# EAGLE design NSE2022_FLYBACK (EAGLE 9.6.0)
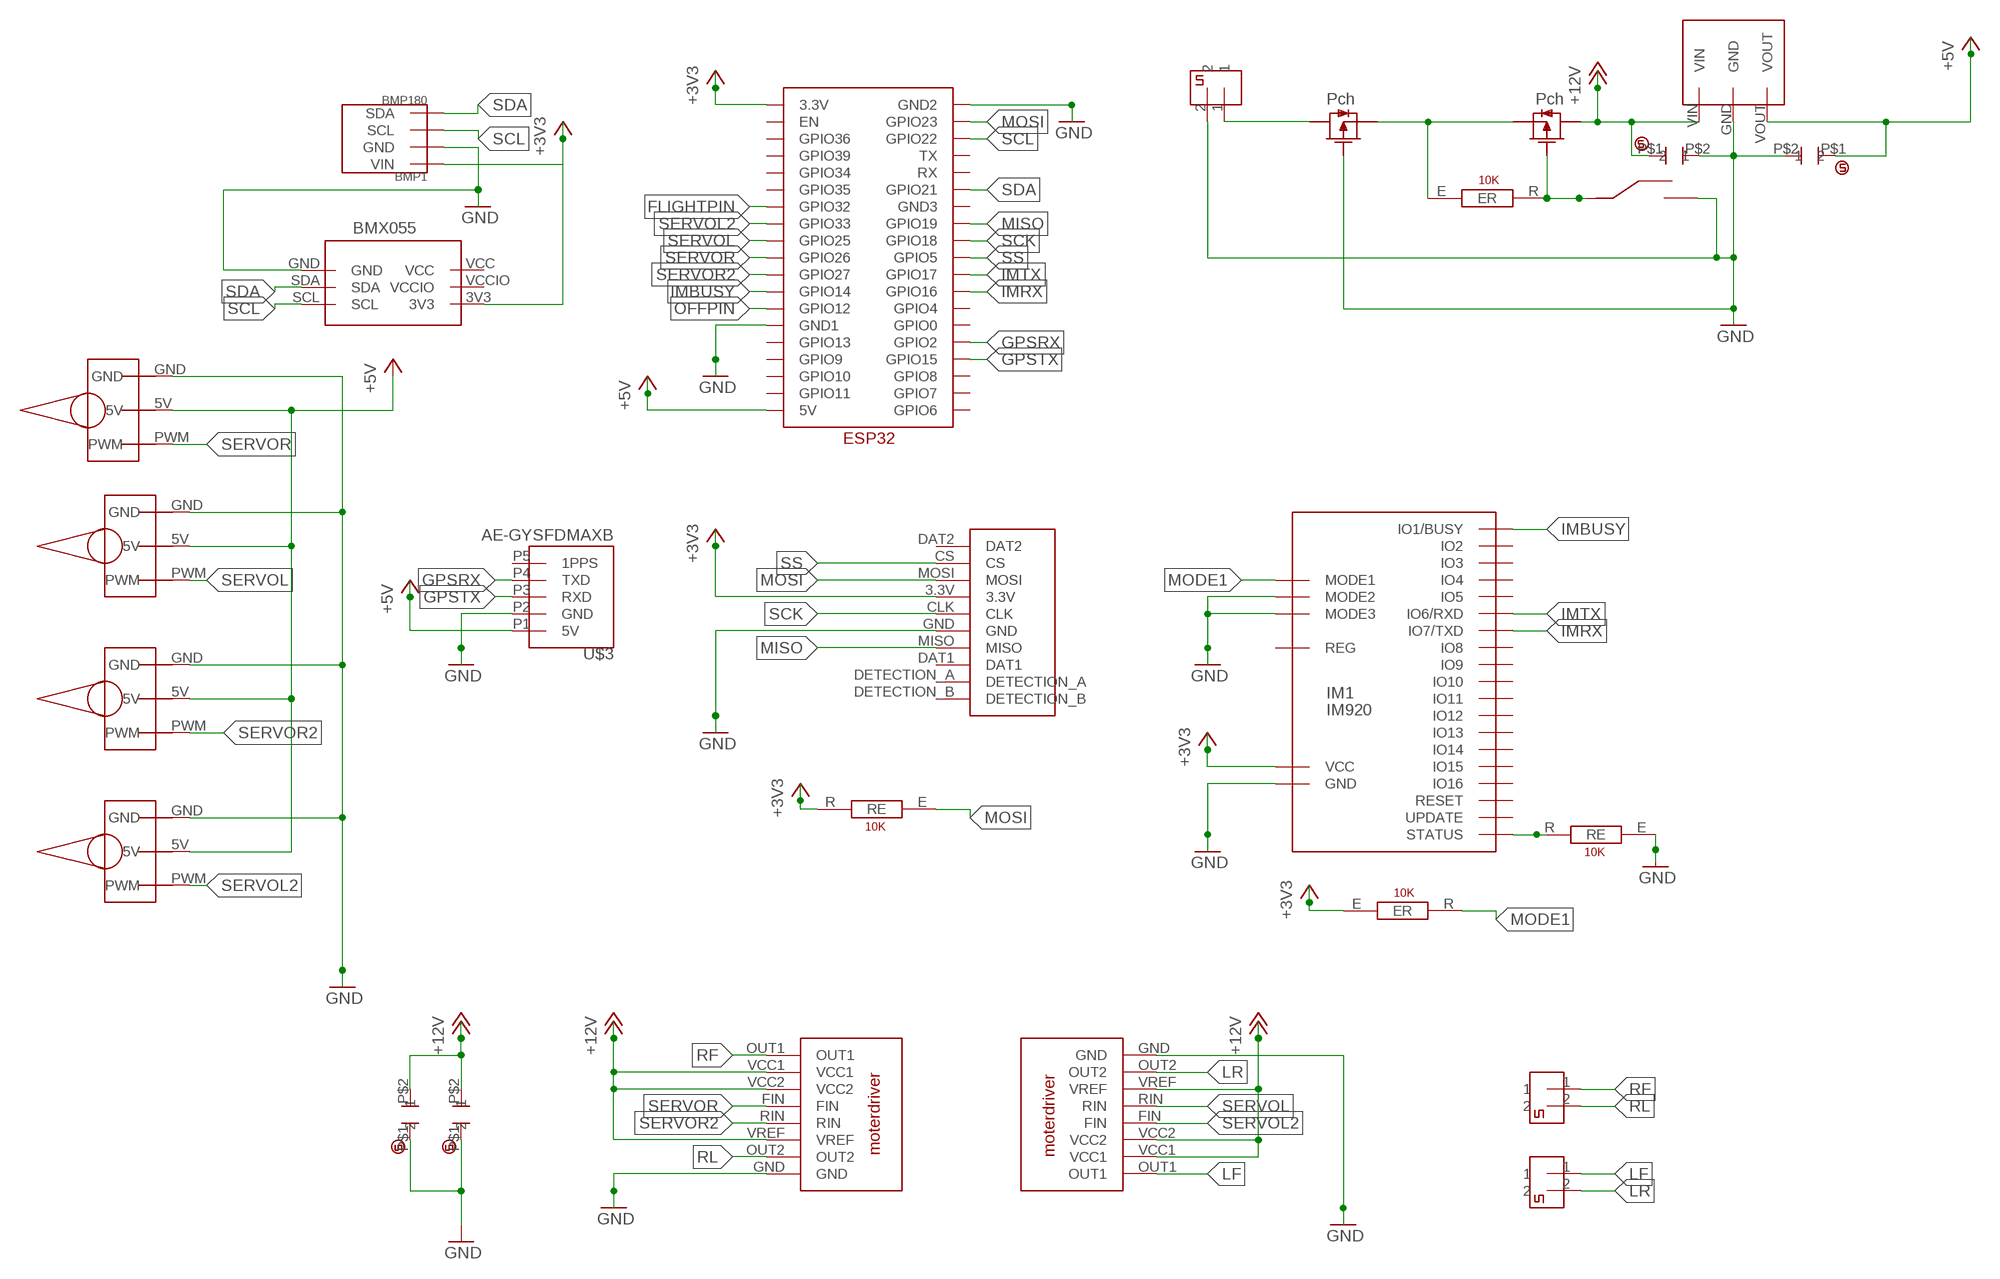
[diagram p0: schematic, sheet 1]

## Parts
BMP1  BMP180  [GY-68]
BMX1  BMX055  [BMX055]
CERAMIC_CAPACITOR1  CERAMIC_CAPACITOR  [CERAMIC_CAPACITOR]
CERAMIC_CAPACITOR2  CERAMIC_CAPACITOR  [CERAMIC_CAPACITOR]
CERAMIC_CAPACITOR3  CERAMIC_CAPACITOR  [CERAMIC_CAPACITOR]
CERAMIC_CAPACITOR4  CERAMIC_CAPACITOR  [CERAMIC_CAPACITOR]
CONNECTION1  SD_SOCKET  [SD]
CONNECTOR1  2PIN  [2PIN]
CONNECTOR2  2PIN  [2PIN]
CONNECTOR3  2PIN  [2PIN]
IM1  IM920  [IM920]
U$1  2SJ681-PCH  [2SJ681]
U$2  MG996R  [MG996R]
U$3  AE-GYSFDMAXB  [AE-GYSFDMAXB]
U$4  ESP32  [ESP32]
U$5  2SJ681-PCH  [2SJ681]
U$6  M78AR05-1  [M78AR05-1]
U$7  KATORESISTOR  [KATORESISTOR]
U$8  SLIDESWITCH  [SLIDESWITCH]
U$9  MG996R  [MG996R]
U$10  MG996R  [MG996R]
U$11  MG996R  [MG996R]
U$12  KATORESISTOR  [KATORESISTOR]
U$13  KATORESISTOR  [KATORESISTOR]
U$14  KATORESISTOR  [KATORESISTOR]
U$15  MOTORDRIVER  [MOTORDRIVER]
U$16  MOTORDRIVER  [MOTORDRIVER]

## Nets
+3V3: BMP1.P1(VIN) BMX1.3V3 CONNECTION1.3.3V IM1.IO23(VCC) U$4.3.3V U$12.E U$14.R
+5V: CERAMIC_CAPACITOR1.P$1 U$2.5V U$3.P1(5V) U$4.5V U$6.VOUT U$9.5V U$10.5V U$11.5V
+12V: CERAMIC_CAPACITOR2.P$1 CERAMIC_CAPACITOR3.P$2 CERAMIC_CAPACITOR4.P$2 U$5.DRAIN U$6.VIN U$15.VCC1 U$15.VCC2 U$15.VREF U$16.VCC1 U$16.VCC2 U$16.VREF
FLIGHTPIN: U$4.GPIO32
GND: BMP1.P2(GND) BMX1.GND CERAMIC_CAPACITOR1.P$2 CERAMIC_CAPACITOR2.P$2 CERAMIC_CAPACITOR3.P$1 CERAMIC_CAPACITOR4.P$1 CONNECTION1.GND CONNECTOR2.2 IM1.IO18(MODE2) IM1.IO19(MODE3) IM1.IO24(GND) U$1.GATE U$2.GND U$3.P2(GND) U$4.GND1 U$6.GND U$8.C U$9.GND U$10.GND U$11.GND U$13.E U$15.GND U$16.GND
GPSRX: U$3.P4(TXD) U$4.GPIO2
GPSTX: U$3.P3(RXD) U$4.GPIO15
IMBUSY: IM1.IO1(IO1/BUSY) U$4.GPIO14
IMRX: IM1.IO7(IO7/TXD) U$4.GPIO16
IMTX: IM1.IO6(IO6/RXD) U$4.GPIO17
LF: CONNECTOR3.1 U$16.OUT1
LR: CONNECTOR3.2 U$16.OUT2
MISO: CONNECTION1.MISO U$4.GPIO19
MODE1: IM1.IO17(MODE1) U$12.R
MOSI: CONNECTION1.MOSI U$4.GPIO23 U$14.E
N$1: U$4.GND2 ; supply symbol labelled GND
N$2: U$1.SOURCE U$5.SOURCE U$7.E
N$4: U$5.GATE U$7.R U$8.A
N$6: CONNECTOR2.1 U$1.DRAIN
N$25: IM1.IO21(STATUS) U$13.R
OFFPIN: U$4.GPIO12
RF: CONNECTOR1.1 U$15.OUT1
RL: CONNECTOR1.2 U$15.OUT2
SCK: CONNECTION1.CLK U$4.GPIO18
SCL: BMP1.P3(SCL) BMX1.SCL U$4.GPIO22
SDA: BMP1.P4(SDA) BMX1.SDA U$4.GPIO21
SERVOL: U$4.GPIO25 U$9.PWM U$16.RIN
SERVOL2: U$4.GPIO33 U$11.PWM U$16.FIN
SERVOR: U$2.PWM U$4.GPIO26 U$15.FIN
SERVOR2: U$4.GPIO27 U$10.PWM U$15.RIN
SS: CONNECTION1.CS U$4.GPIO5
Unconnected: CONNECTION1.DAT1 CONNECTION1.DAT2 CONNECTION1.DETECTION_A CONNECTION1.DETECTION_B IM1.IO2 IM1.IO3 IM1.IO4 IM1.IO5 IM1.IO8 IM1.IO9 IM1.IO10 IM1.IO11 IM1.IO12 IM1.IO13 IM1.IO14 IM1.IO15 IM1.IO16 IM1.IO20(UPDATE) IM1.IO22(REG) IM1.IO25(RESET) U$3.P5(1PPS) U$4.EN U$4.GND3 U$4.GPIO0 U$4.GPIO4 U$4.GPIO6 U$4.GPIO7 U$4.GPIO8 U$4.GPIO9 U$4.GPIO10 U$4.GPIO11 U$4.GPIO13 U$4.GPIO34 U$4.GPIO35 U$4.GPIO36 U$4.GPIO39 U$4.RX U$4.TX U$8.B

## Power pins joined to a net without a drawn wire
VCC: BMX1.VCC
VCCIO: BMX1.VCCIO

## Library data of the parts
BMP1 = BMP180:BMP180
BMX1 = BMX055:BMX055
CERAMIC_CAPACITOR1-CERAMIC_CAPACITOR4 = capacitor:CERAMIC_CAPACITOR: ceramic_capacitor
CONNECTION1 = SD_card_socket:SD_SOCKET: SD card socket
CONNECTOR1-CONNECTOR3 = 2pin_small:2PIN: 2pin
IM1 = IM920:IM920
U$1 U$5 = MOSFET:2SJ681-PCH
U$2 U$9-U$11 = MG996R:MG996R
U$3 = AE-GYSFDMAXB:AE-GYSFDMAXB
U$4 = ESP32:ESP32
U$6 = M78AR05-1:M78AR05-1
U$7 U$12-U$14 = KATORESISTER:KATORESISTOR
U$8 = SLIDESWITCH:SLIDESWITCH
U$15 U$16 = motordriver:MOTORDRIVER

## Board
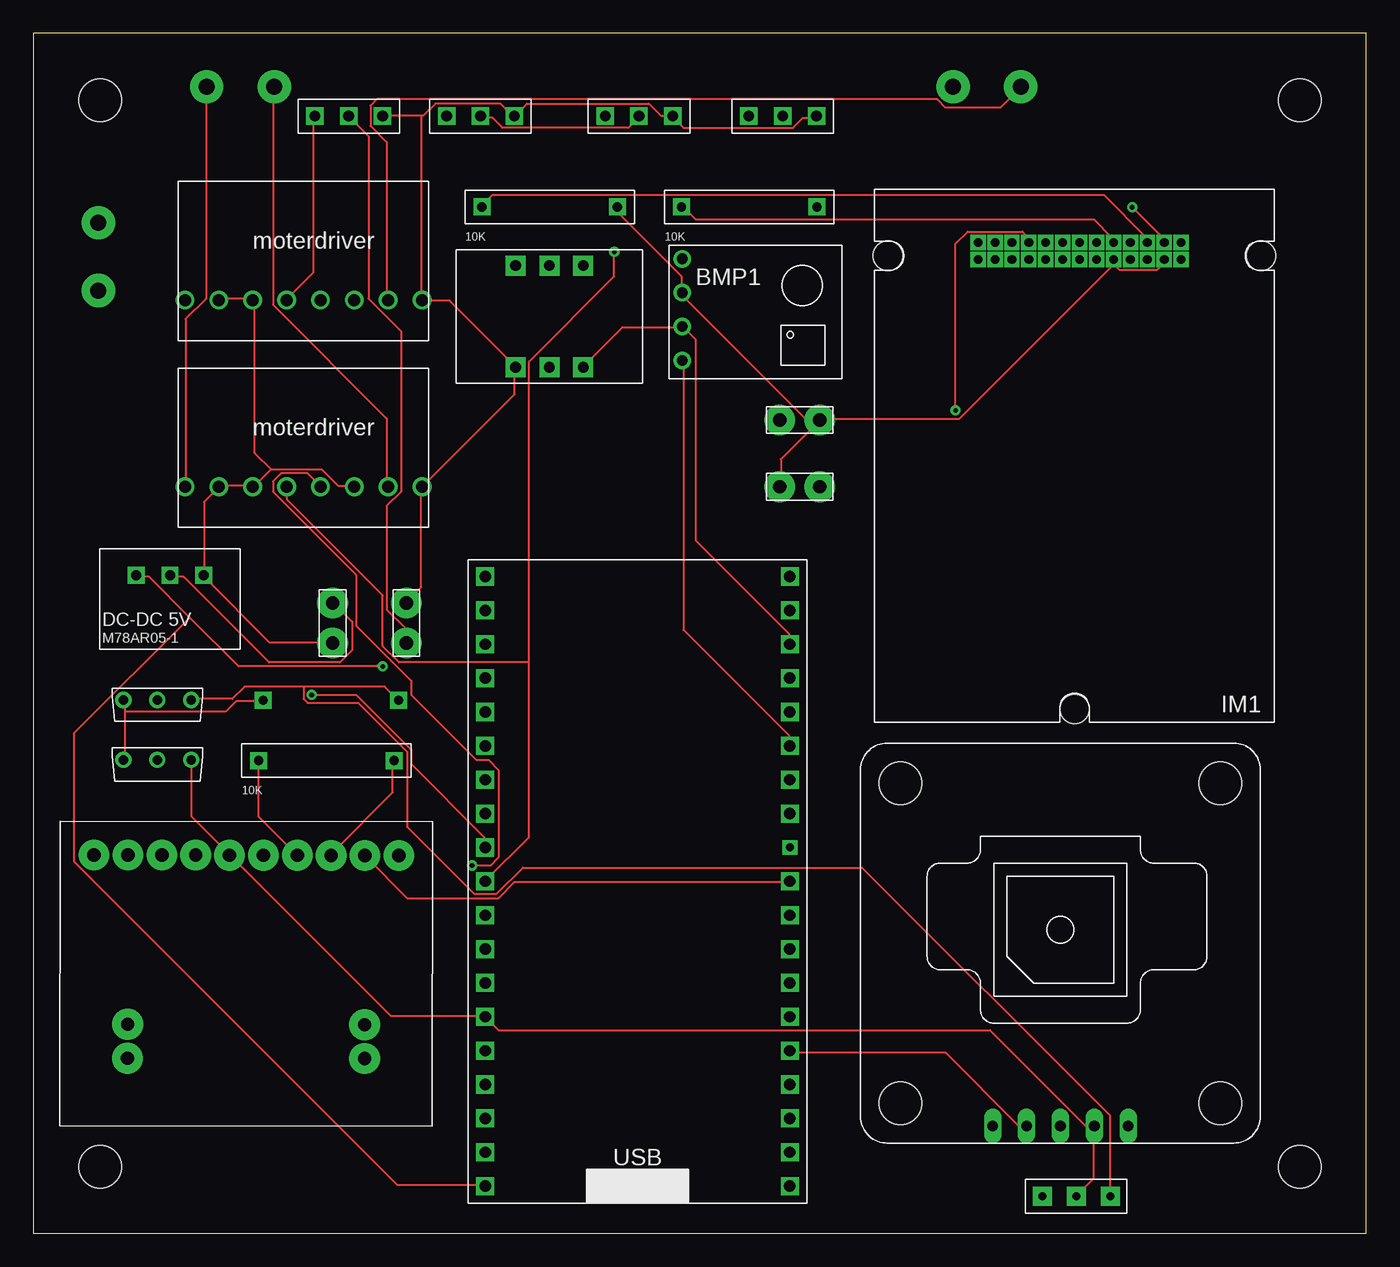
[diagram p1: board, top side]
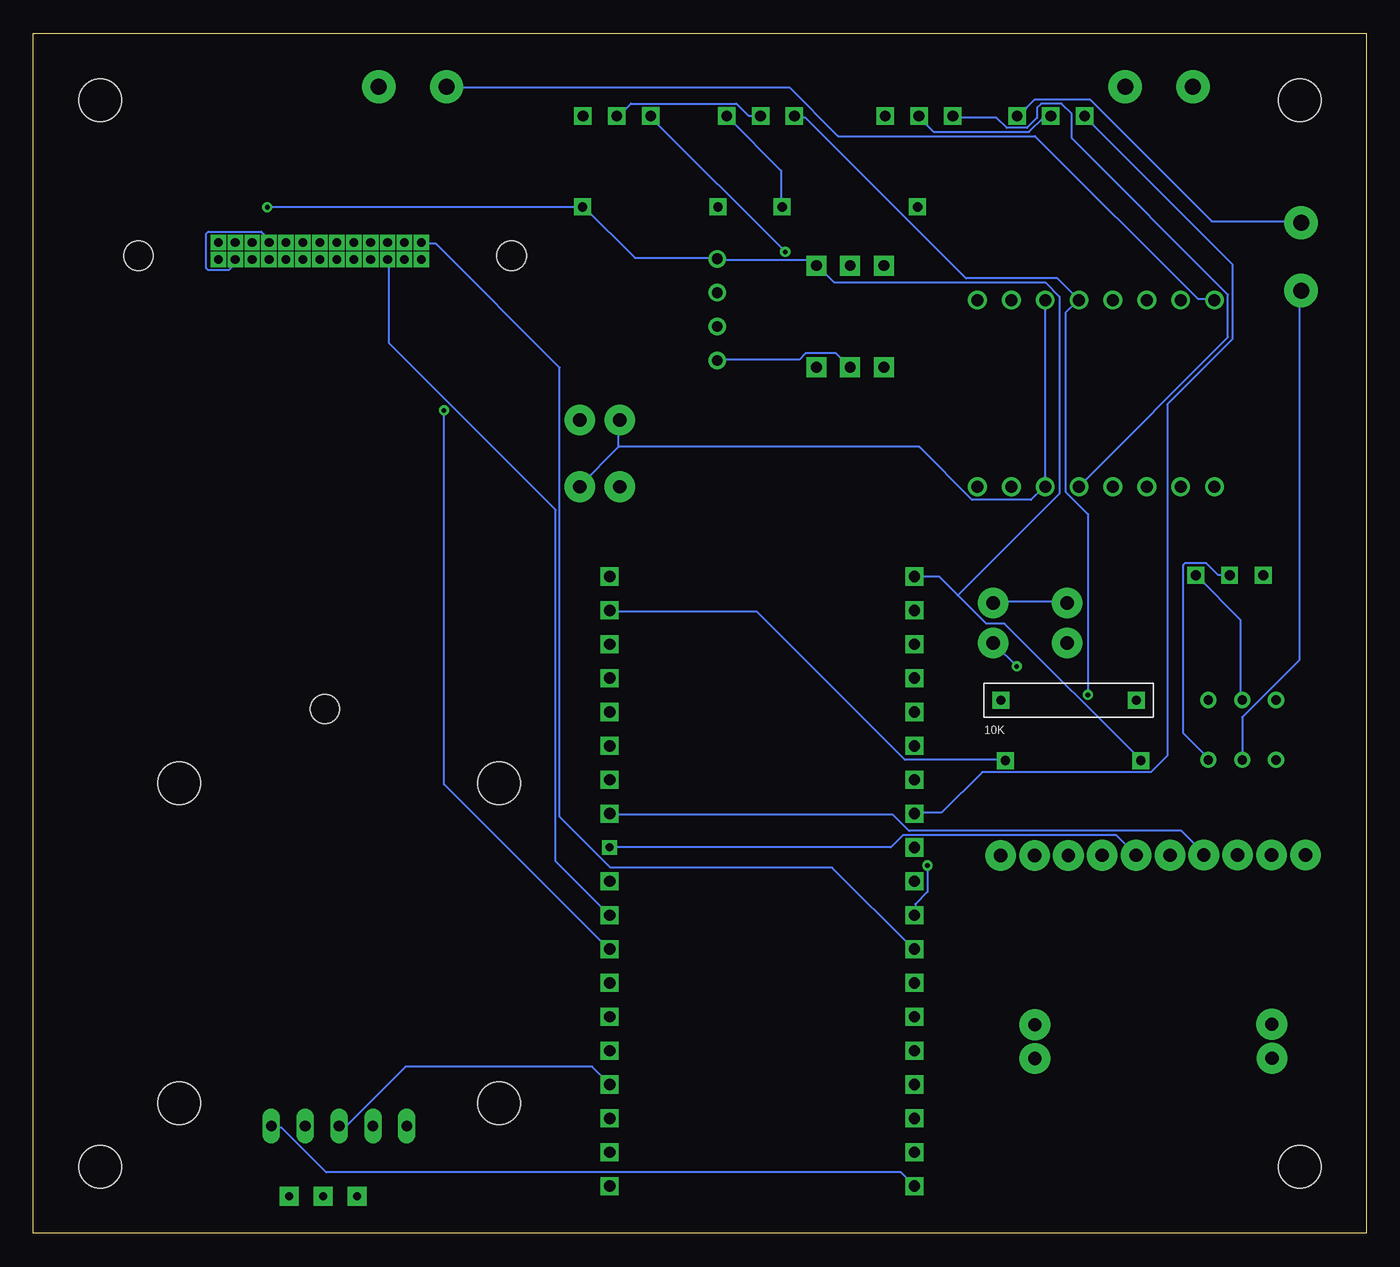
[diagram p2: board, bottom side, seen from below]

Size 100 x 90 mm. Coordinates in mm from the lower left corner, seen from the top.
Outline: 0,0 100,0 100,90 0,90 0,0
Copper layers (1*16): Top 0.035mm / dielectric 1.5mm / Bottom 0.035mm
Design rules "default": minimum track width 6mil, minimum drill 0.35mm, track to track 6mil, track to pad 6mil, pad to pad 6mil, via to via 6mil, smd to smd 6mil, copper to edge 40mil, drill to drill 6mil, minimum pad ring 10mil, minimum via ring 8mil, stop-mask expansion 4mil, vias tented up to drill 0mil, thermal gap 10mil
Holes 3.2 mm at 5,5 5,85 95,85 95,5
Holes 0.35 mm at -39,60

### Footprints (pad centres in the part's own frame; a part is rotated, then mirrored left to right if it is on the bottom)
GY-68 = drill 0.8: P1 -5,4; P2 -5,1.46; P3 -5,-1.08; P4 -5,-3.62
BMX055 = drill 0.8 pad 1.5 square: 3V3 8.81,-9.53; GND 1.19,-4.46; SCL 1.19,-9.53; SDA 1.19,-7; VCC 8.81,-4.46; VCCIO 8.81,-7
CERAMIC_CAPACITOR = drill 1 pad 2.3: P$1 0,0; P$2 0,3
SD = drill 1 pad 2.3: 3.3V 7.62,0; CLK 10.16,0; CS 2.54,0; CS1 2.54,12.7; CS2 2.54,15.24; DAT1 17.78,0; DAT2 0,0; DETECTION_A 20.32,0; DETECTION_A1 20.32,12.7; DETECTION_A2 20.32,15.24; DETECTION_B 22.86,0; GND 12.7,0; MISO 15.24,0; MOSI 5.08,0
2PIN = drill 1.2 pad 2.5: 1 0,0; 2 5.08,0
IM920 = drill 0.65 square: IO1 7.24,-16; IO2 7.24,-14.73; IO3 5.97,-16; IO4 5.97,-14.73; IO5 4.7,-16; IO6 4.7,-14.73; IO7 3.43,-16; IO8 3.43,-14.73; IO9 2.16,-16; IO10 2.16,-14.73; IO11 0.89,-16; IO12 0.89,-14.73; IO13 -0.38,-16; IO14 -0.38,-14.73; IO15 -1.65,-16; IO16 -1.65,-14.73; IO17 -2.92,-16; IO18 -2.92,-14.73; IO19 -4.19,-16; IO20 -4.19,-14.73; IO21 -5.46,-16; IO22 -5.46,-14.73; IO23 -6.73,-16; IO24 -6.73,-14.73; IO25 -8,-16; IO26 -8,-14.73 | hole 2.2: -14,-15; 14,-15; 0,19
2SJ681 = drill 0.7: DRAIN 0,0; GATE 2.54,0; SOURCE -2.54,0
MG996R = drill 0.8 pad 1.27 square: 5V 2.54,0; GND 5.08,0; PWM 0,0
AE-GYSFDMAXB = drill 0.8 long: P1 13.716,5.08; P2 13.716,2.54; P3 13.716,0; P4 13.716,-2.54; P5 13.716,-5.08 | hole 3.2: -12,12; 12,12; 12,-12; -12,-12
ESP32 = drill 0.85 square: 3.3V 1.27,46.99; 5V 1.27,1.27; EN 1.27,44.45; GND1 1.27,13.97; GND2 24.13,46.99; GND3 24.13,31.75; GPIO0 24.13,13.97; GPIO2 24.13,11.43; GPIO4 24.13,16.51; GPIO5 24.13,24.13; GPIO6 24.13,1.27; GPIO7 24.13,3.81; GPIO8 24.13,6.35; GPIO9 1.27,8.89; GPIO10 1.27,6.35; GPIO11 1.27,3.81; GPIO12 1.27,16.51; GPIO13 1.27,11.43; GPIO14 1.27,19.05; GPIO15 24.13,8.89; GPIO16 24.13,19.05; GPIO17 24.13,21.59; GPIO19 24.13,29.21; GPIO21 24.13,34.29; GPIO22 24.13,41.91; GPIO23 24.13,44.45; GPIO25 1.27,26.67; GPIO26 1.27,24.13; GPIO27 1.27,21.59; GPIO32 1.27,31.75; GPIO33 1.27,29.21; GPIO34 1.27,36.83; GPIO35 1.27,34.29; GPIO36 1.27,41.91; GPIO39 1.27,39.37; RX 24.13,36.83; TX 24.13,39.37 | drill 0.6 square: GPIO18 24.13,26.67
M78AR05-1 = drill 0.75 pad 1.27 square: GND 0,0; VIN 2.54,0; VOUT -2.54,0
KATORESISTOR = drill 0.7 pad 1.27 square: E 10.16,1.27; R 0,1.27
SLIDESWITCH = drill 0.6 pad 1.422 square: A 0,0; B 5.08,0; C 2.54,0
MOTORDRIVER = drill 0.9: FIN 0,0; GND 10.16,0; OUT1 -7.62,0; OUT2 7.62,0; RIN 2.54,0; VCC1 -5.08,0; VCC2 -2.54,0; VREF 5.08,0

### Placement (x,y rotation side)
BMP1  53.68,69.09 0 top
BMX1  31.72,63.77 90 top
CERAMIC_CAPACITOR1  27.99,44.28 0 top
CERAMIC_CAPACITOR2  22.45,44.28 0 top
CERAMIC_CAPACITOR3  56,56 270 top
CERAMIC_CAPACITOR4  59,61 90 top
CONNECTION1  27.42,28.34 179.9 top
CONNECTOR1  13,86 0 top
CONNECTOR2  4.88,70.71 90 top
CONNECTOR3  69,86 0 top
IM1  78.12,58.32 180 top
U$1  9.3,35.51 0 top
U$2  53.68,83.79 0 top
U$3  77.06,21.77 270 top
U$4  32.63,2.27 0 top
U$5  9.3,40 0 top
U$6  10.25,49.36 0 top
U$7  27.4,38.71 0 bottom
U$8  80.79,2.79 180 top
U$9  42.9,83.79 0 top
U$10  31.01,83.79 0 top
U$11  21.12,83.79 0 top
U$12  48.63,75.71 0 top
U$13  33.66,75.71 0 top
U$14  16.91,34.19 0 top
U$15  19,56 0 top
U$16  19,70 0 top

### Tracks (layer width: path | path; a pad name or v marks a point on that pad's centre or on a via)
+3V3  (via drill 0.35)
  Top 0.152: U$14.R 16.92,35.36 16.92,31.24 19.66,28.5 CONNECTION1.3.3V | v82.45,76.96 84.73,74.68 84.73,74.37 IM1.IO23
  Bottom 0.152: 30.63,47.85 28.5,45.72 27.13,45.72 16.92,35.51 U$14.R | 30.63,47.85 32,49.23 33.83,49.23 U$4.3.3V | v82.45,76.96 58.83,76.96 U$12.E 58.67,76.96 54.86,73.15 48.77,73.15 BMP1.P1 48.62,73 41.6,73 41.3,72.69 BMX1.3V3 41.15,72.54 39.93,71.32 24.08,71.32 23.01,70.26 23.01,55.47 30.63,47.85
+5V  (via drill 0.35)
  Top 0.152: 11.73,46.18 15.39,42.52 v26.21,42.52 | 11.73,46.18 8.69,49.23 7.77,49.23 U$6.VOUT | U$10.5V 33.68,83.67 34.44,83.67 35.2,82.91 44.65,82.91 45.41,83.67 U$9.5V | CERAMIC_CAPACITOR1.P$1 27.89,44.35 27.89,45.41 26.52,46.79 26.52,54.56 27.58,55.63 27.58,67.67 25.15,70.1 25.15,82.3 23.77,83.67 U$11.5V | 11.73,46.18 3.05,37.49 3.05,27.89 27.28,3.66 33.83,3.66 U$4.5V
  Bottom 0.152: U$3.P1 81.99,7.92 81.38,7.92 78.03,4.57 34.9,4.57 33.98,3.66 U$4.5V | v26.21,42.52 27.89,44.2 CERAMIC_CAPACITOR1.P$1 | U$11.5V 23.77,83.67 24.23,83.67 25.3,82.6 32.46,82.6 33.53,83.67 U$10.5V | U$9.5V 45.57,83.82 46.33,83.82 47.24,84.73 55.17,84.73 56.08,83.82 U$2.5V
+12V
  Top 0.152: CERAMIC_CAPACITOR2.P$1 22.4,44.35 17.68,44.35 12.8,49.23 U$6.VIN 12.8,49.38 12.8,54.86 13.87,55.93 U$15.VCC1 14.02,56.08 16.46,56.08 U$15.VCC2 16.61,56.08 17.83,57.3 | U$16.VCC1 14.02,70.1 16.46,70.1 U$16.VCC2 16.61,69.95 16.61,58.52 17.83,57.3 | 17.83,57.3 21.64,57.3 22.86,56.08 24.08,56.08 U$15.VREF
  Bottom 0.152: U$5.DRAIN 9.45,40.08 9.45,46.02 12.65,49.23 U$6.VIN | 56.08,58.98 56.08,60.96 CERAMIC_CAPACITOR4.P$2 | 56.08,58.98 58.98,56.08 CERAMIC_CAPACITOR3.P$2 | U$16.VREF 24.08,69.95 24.08,56.08 U$15.VREF 24.23,55.93 25.15,55.02 29.57,55.02 33.53,58.98 56.08,58.98
GND
  Top 0.152: U$8.C 78.33,2.9 79.55,4.12 79.55,7.92 U$3.P2 79.55,8.08 78.94,8.08 71.78,15.24 34.9,15.24 33.98,16.15 U$4.GND1 33.83,16.31 26.82,16.31 14.78,28.35 CONNECTION1.GND 14.63,28.5 11.89,31.24 11.89,35.51 U$1.GATE | 81.08,72.69 81.08,73 IM1.IO18 81.08,72.69 | 81.08,72.69 81.53,72.24 84.28,72.24 84.73,72.69 84.73,73 IM1.IO24 | 81.08,72.69 69.49,61.11 59.13,61.11 CERAMIC_CAPACITOR4.P$1 | 58.52,60.5 58.98,60.96 CERAMIC_CAPACITOR4.P$1 | 58.52,60.5 56.08,58.06 56.08,56.08 CERAMIC_CAPACITOR3.P$1 | CERAMIC_CAPACITOR1.P$2 28.04,47.4 29.11,48.46 29.11,55.93 U$15.GND 29.26,56.08 36.12,62.94 36.12,64.92 BMX1.GND 36.12,65.08 31.24,69.95 29.26,69.95 U$16.GND 29.11,70.1 29.11,83.82 | U$13.E 43.89,76.96 43.89,76.5 48.62,71.78 48.62,70.56 BMP1.P2 48.62,70.41 58.52,60.5 | U$2.GND 58.67,83.67 57.76,83.67 57,82.91 48.77,82.91 48.01,83.67 U$9.GND 47.85,83.82 47.09,83.82 46.18,84.73 37.03,84.73 36.12,83.82 U$10.GND 35.97,83.82 35.05,84.73 30.18,84.73 29.26,83.82 29.11,83.82 | 29.11,83.82 26.21,83.82 U$11.GND | 58.52,60.5 CERAMIC_CAPACITOR4.P$1 | U$6.GND 10.36,49.23 11.28,49.23 17.68,42.82 23.01,42.82 23.93,43.74 23.93,45.87 22.55,47.24 CERAMIC_CAPACITOR2.P$2
  Bottom 0.152: U$6.GND 10.36,49.38 11.12,49.38 12.04,50.29 13.56,50.29 13.72,50.14 13.72,37.49 11.89,35.66 U$1.GATE | IM1.IO19 82.45,74.37 82.45,74.68 82.91,75.13 86.87,75.13 87.02,74.98 87.02,72.39 86.87,72.24 85.34,72.24 84.89,72.69 84.89,73 IM1.IO24 | CERAMIC_CAPACITOR2.P$2 22.55,47.4 27.89,47.4 CERAMIC_CAPACITOR1.P$2 | U$13.E 43.89,77.11 43.89,79.7 47.85,83.67 U$9.GND | CONNECTOR2.2 5.03,75.89 11.58,75.89 20.73,85.04 24.84,85.04 26.06,83.82 U$11.GND
GPSRX
  Top 0.152: U$3.P4 74.37,8.08 73.91,8.08 68.43,13.56 56.84,13.56 U$4.GPIO2
GPSTX
  Bottom 0.152: U$3.P3 76.96,8.08 76.5,8.08 72.08,12.5 58.06,12.5 56.84,11.28 U$4.GPIO15
IMBUSY
  Bottom 0.152: IM1.IO1 70.87,74.22 69.8,74.22 60.5,64.92 60.5,31.24 56.69,27.43 40.08,27.43 33.98,21.34 U$4.GPIO14
IMRX  (via drill 0.35)
  Top 0.152: v69.19,61.72 69.19,74.22 70.1,75.13 74.22,75.13 74.68,74.68 74.68,74.37 IM1.IO7
  Bottom 0.152: v69.19,61.72 69.19,33.68 56.84,21.34 U$4.GPIO16
IMTX
  Bottom 0.152: IM1.IO6 73.3,73 73.3,66.75 60.81,54.25 60.81,27.89 56.84,23.93 U$4.GPIO17
LF
  Bottom 0.152: U$16.OUT1 11.43,70.1 12.65,70.1 24.84,82.3 39.62,82.3 43.28,85.95 68.89,85.95 CONNECTOR3.1
LR
  Top 0.152: U$16.OUT2 26.52,70.1 26.52,81.84 25.3,83.06 25.3,84.58 25.76,85.04 67.82,85.04 68.43,84.43 72.54,84.43 74.07,85.95 CONNECTOR3.2
MISO
  Bottom 0.152: U$4.GPIO19 56.69,31.39 35.51,31.39 34.29,30.18 13.87,30.18 12.19,28.5 CONNECTION1.MISO
MODE1
  Top 0.152: IM1.IO17 80.92,74.37 80.92,74.68 79.55,76.05 49.68,76.05 48.77,76.96 U$12.R
MOSI
  Top 0.152: U$14.E 26.98,35.36 26.98,33.07 22.4,28.5 CONNECTION1.MOSI
  Bottom 0.152: U$4.GPIO23 56.69,46.63 45.72,46.63 34.59,35.51 27.13,35.51 U$14.E
N$2
  Top 0.152: 6.86,39.17 6.86,39.93 U$5.SOURCE | 6.86,39.17 6.86,35.66 U$1.SOURCE | 6.86,39.17 14.48,39.17 15.24,39.93 17.22,39.93 U$7.E
N$4
  Top 0.152: 20.27,41 26.36,41 27.28,40.08 U$7.R | 20.27,41 15.85,41 14.94,40.08 11.89,40.08 U$5.GATE | 20.27,41 20.27,40.08 20.57,39.78 24.38,39.78 28.04,36.12 28.04,30.48 33.07,25.45 34.75,25.45 36.73,27.43 62.18,27.43 80.77,8.84 80.77,2.9 U$8.A
N$6
  Bottom 0.152: U$1.DRAIN 9.3,35.66 9.3,38.71 5.03,42.98 5.03,70.56 CONNECTOR2.1
N$25
  Top 0.152: IM1.IO21 83.52,74.37 83.52,74.68 80.31,77.88 34.44,77.88 33.68,77.11 U$13.R
RF
  Top 0.152: U$15.OUT1 11.43,56.08 11.43,68.58 12.95,70.1 12.95,85.95 CONNECTOR1.1
RL
  Top 0.152: U$15.OUT2 26.52,56.08 26.52,61.11 17.98,69.65 17.98,85.95 CONNECTOR1.2
SCK
  Bottom 0.152: U$4.GPIO18 56.69,28.96 35.66,28.96 34.75,29.87 18.75,29.87 17.37,28.5 CONNECTION1.CLK
SCL
  Top 0.152: BMX1.SCL 41.3,65.08 44.2,67.97 48.62,67.97 BMP1.P3 48.77,67.97 49.68,67.06 49.68,51.97 56.69,44.96 56.69,44.2 U$4.GPIO22
SDA
  Top 0.152: U$4.GPIO21 56.69,36.58 56.69,37.34 48.77,45.26 48.77,65.38 BMP1.P4
  Bottom 0.152: BMP1.P4 48.62,65.53 42.52,65.53 42.06,65.99 39.78,65.99 38.86,65.08 BMX1.SDA
SERVOL  (via drill 0.35)
  Top 0.152: v20.88,40.39 24.23,40.39 28.35,36.27 28.35,35.2 33.83,29.72 33.83,28.96 U$4.GPIO25
  Bottom 0.152: U$9.PWM 42.82,83.67 42.06,83.67 30.02,71.63 23.16,71.63 21.64,70.1 U$16.RIN 21.64,69.95 22.55,69.04 22.55,55.63 20.88,53.95 v20.88,40.39
SERVOL2
  Top 0.152: U$11.PWM 21.03,83.67 21.03,72.08 19.05,70.1 U$16.FIN
  Bottom 0.152: U$4.GPIO33 33.83,31.55 31.85,31.55 28.8,34.59 16.15,34.59 14.94,35.81 14.94,62.18 10.06,67.06 10.06,72.69 21.03,83.67 U$11.PWM
SERVOR  (via drill 0.35)
  Top 0.152: v43.59,73.61 43.59,71.78 37.19,65.38 37.19,42.82 | 37.19,42.82 37.19,29.72 33.98,26.52 U$4.GPIO26 | 37.19,42.82 27.43,42.82 26.21,44.04 26.21,47.85 19.05,55.02 19.05,55.93 U$15.FIN
  Bottom 0.152: v43.59,73.61 53.65,83.67 U$2.PWM
SERVOR2  (via drill 0.35)
  Top 0.152: v32.92,27.58 34.29,27.58 34.9,28.19 34.9,34.75 34.14,35.51 33.22,35.51 28.35,40.39 28.35,41.45 24.23,45.57 24.23,49.38 17.98,55.63 17.98,56.39 18.59,57 20.57,57 21.49,56.08 U$15.RIN
  Bottom 0.152: U$10.PWM 30.94,83.67 27.74,83.67 26.98,82.91 25.45,82.91 24.69,83.67 24.69,84.43 24.38,84.73 22.86,84.73 22.1,83.97 22.1,82.14 10.36,70.41 10.36,67.21 21.49,56.08 U$15.RIN | v32.92,27.58 32.92,25.6 33.83,24.69 33.83,23.93 U$4.GPIO27
SS
  Top 0.152: U$4.GPIO5 56.69,26.36 36.12,26.36 34.9,25.15 28.04,25.15 24.99,28.19 CONNECTION1.CS